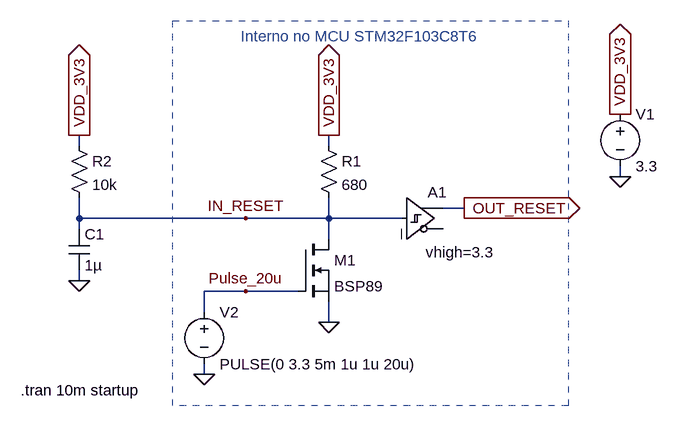
[diagram p0: schematic STM32_Reset.asc]
STM32_Reset.asc, the LTspice schematic file:
Version 4
SHEET 1 880 680
WIRE -336 -80 -336 -96
WIRE 48 -80 48 -96
WIRE 496 -32 496 -48
WIRE 256 16 224 16
WIRE -336 32 -336 0
WIRE -80 32 -336 32
WIRE 48 32 48 0
WIRE 48 32 -80 32
WIRE 160 32 48 32
WIRE -336 48 -336 32
WIRE 48 64 48 32
WIRE -336 128 -336 112
WIRE -80 144 -144 144
WIRE 0 144 -80 144
WIRE -144 176 -144 144
WIRE 48 192 48 160
WIRE -144 272 -144 256
FLAG 496 -32 0
FLAG 496 -128 VDD_3V3
IOPIN 496 -128 Out
FLAG 48 -96 VDD_3V3
IOPIN 48 -96 Out
FLAG 48 192 0
FLAG -144 272 0
FLAG 256 16 OUT_RESET
IOPIN 256 16 Out
FLAG -336 -96 VDD_3V3
IOPIN -336 -96 Out
FLAG -336 128 0
FLAG -80 32 IN_RESET
FLAG -80 144 Pulse_20u
SYMBOL voltage 496 -144 R0
WINDOW 123 0 0 Left 0
WINDOW 39 0 0 Left 0
SYMATTR InstName V1
SYMATTR Value 3.3
SYMBOL res 32 -96 R0
SYMATTR InstName R1
SYMATTR Value 680
SYMBOL nmos 0 64 R0
SYMATTR InstName M1
SYMATTR Value BSP89
SYMBOL voltage -144 160 R0
WINDOW 123 0 0 Left 0
WINDOW 39 0 0 Left 0
SYMATTR InstName V2
SYMATTR Value PULSE(0 3.3 5m 1u 1u 20u)
SYMBOL Digital\\schmitt 160 -32 R0
WINDOW 39 37 116 Left 2
SYMATTR InstName A1
SYMATTR SpiceLine vhigh=3.3
SYMBOL res -352 -96 R0
SYMATTR InstName R2
SYMATTR Value 10k
SYMBOL cap -352 48 R0
SYMATTR InstName C1
SYMATTR Value 1µ
TEXT -426 296 Left 2 !.tran 10m startup
TEXT -88 -248 Left 2 ;Interno no MCU STM32F103C8T6
RECTANGLE Normal 416 320 -192 -272 2

The netlist it stands for:
* STM32_Reset.asc
V1 VDD_3V3 0 3.3
R1 VDD_3V3 IN_RESET 680
M1 IN_RESET Pulse_20u 0 0 BSP89
V2 Pulse_20u 0 PULSE(0 3.3 5m 1u 1u 20u)
A1 IN_RESET 0 0 0 0 0 OUT_RESET 0 SCHMITT vhigh=3.3
R2 VDD_3V3 IN_RESET 10k
C1 IN_RESET 0 1µ
.model NMOS NMOS
.model PMOS PMOS
.lib standard.mos
.tran 10m startup
* Interno no MCU STM32F103C8T6
.backanno
.end